# Altium project Relay Controller REV2.PrjPcb
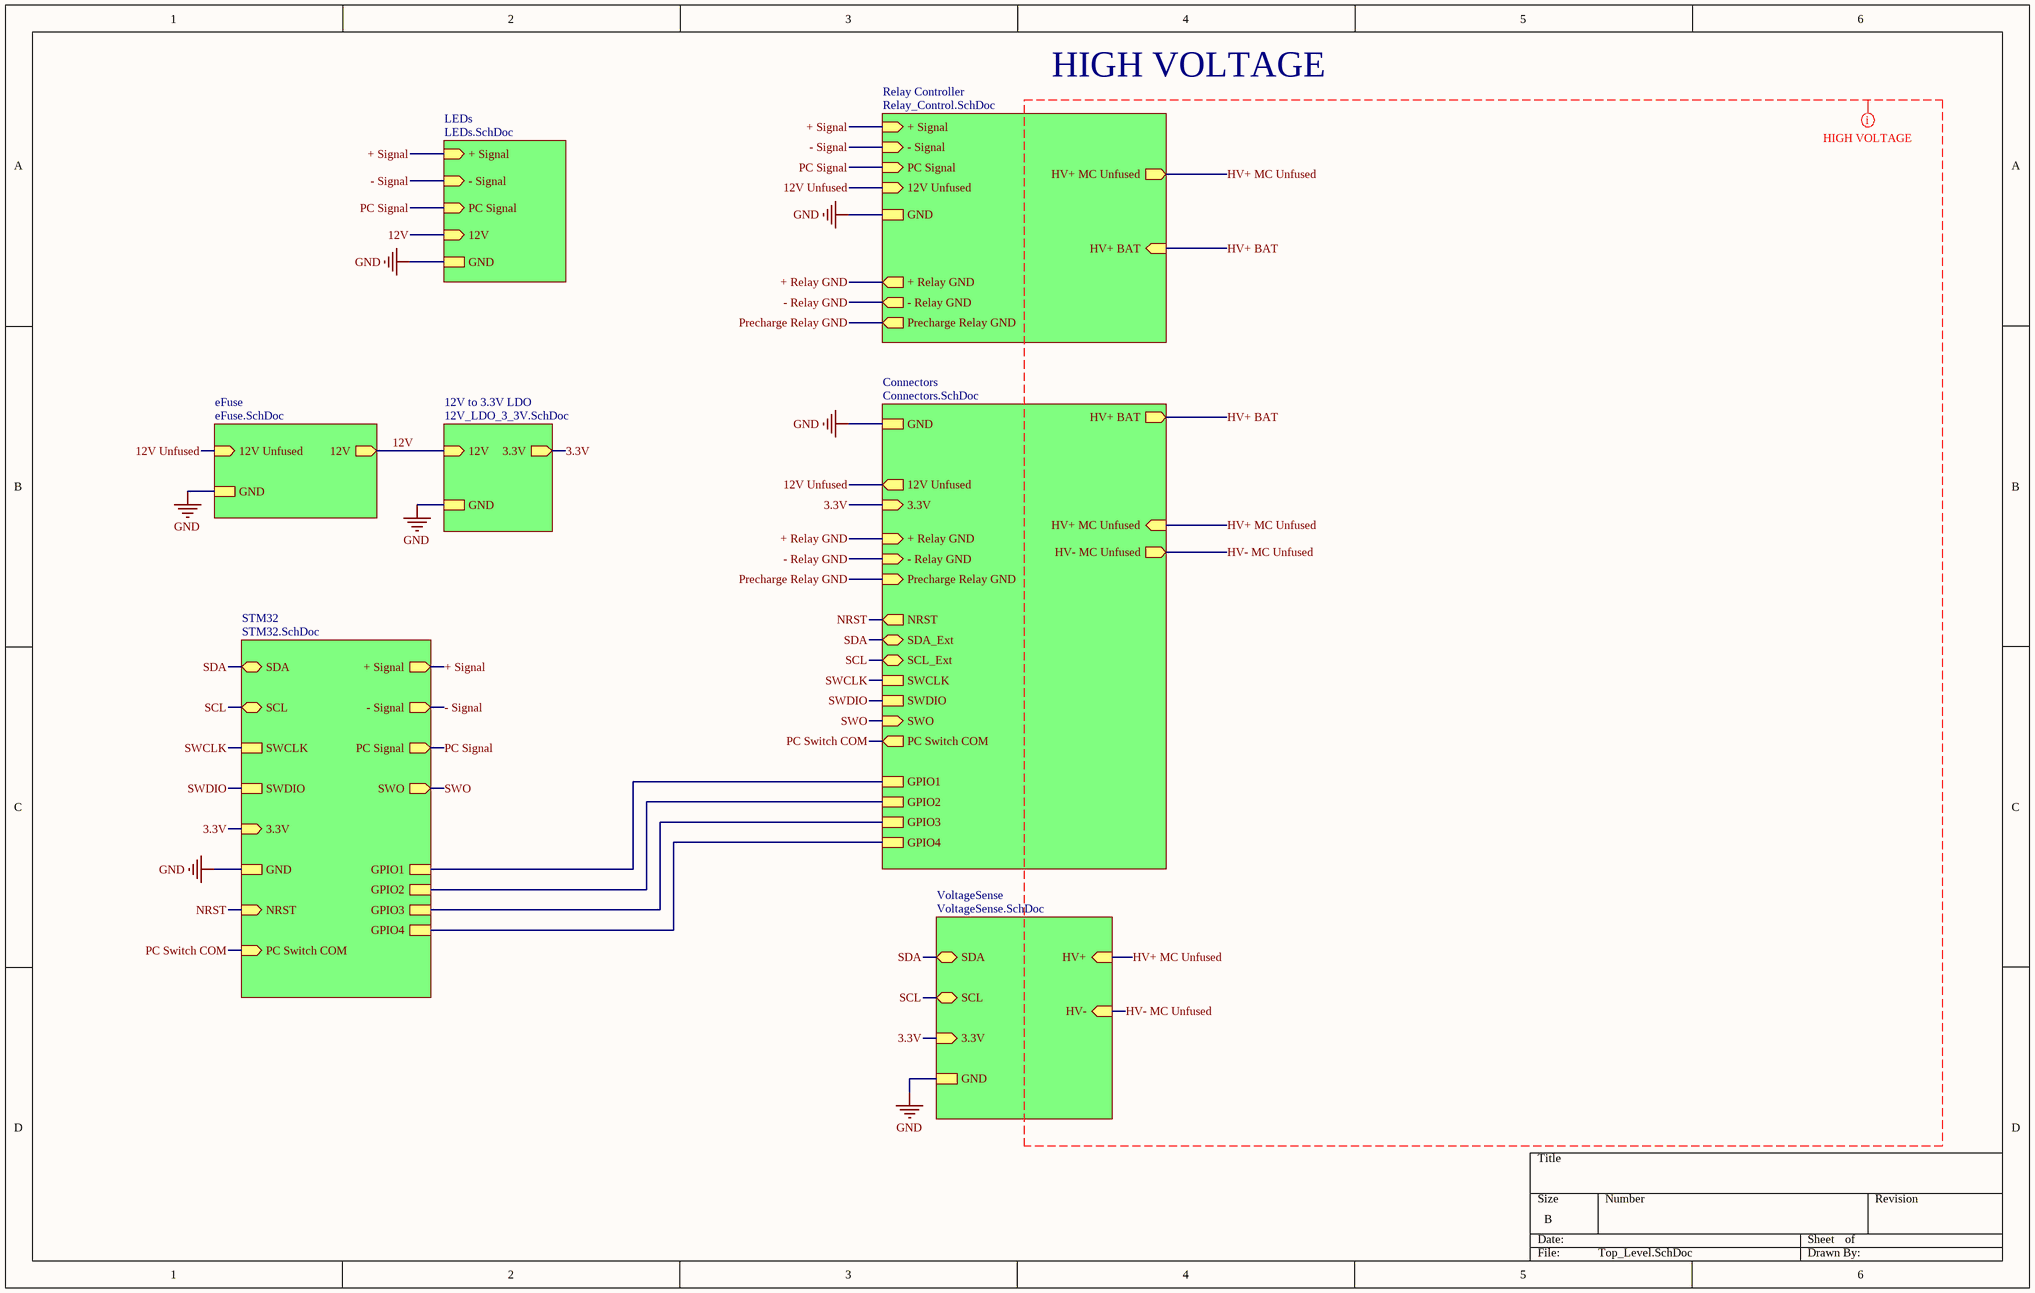
[diagram p0: Top_Level.SchDoc]
9 sheets, 78 parts. Net scope: hierarchical (ports join the sheet entries above them; power ports are global).
Board file: Relay_Controller_REV2.PcbDoc
Sheets:
  Top_Level.SchDoc
    Relay Controller = Relay_Control.SchDoc
    Connectors = Connectors.SchDoc
    LEDs = LEDs.SchDoc
      U_LED = LED_Driver.SchDoc
      U_LED = LED_Driver.SchDoc
      U_LED = LED_Driver.SchDoc
    STM32 = STM32.SchDoc
    VoltageSense = VoltageSense.SchDoc
    eFuse = eFuse.SchDoc
    12V to 3.3V LDO = 12V_LDO_3_3V.SchDoc

## Sheet Top_Level.SchDoc
size B; SheetNumber: 5; SheetTotal: 5

### Sub-sheets
12V to 3.3V LDO = 12V_LDO_3_3V.SchDoc: 12V (in), GND, 3.3V (out)
Connectors = Connectors.SchDoc: GND, + Relay GND (in), - Relay GND (in), Precharge Relay GND (in), HV+ BAT (out), 12V Unfused (out), HV+ MC Unfused (in), HV- MC Unfused (out), 3.3V (in), SDA_Ext (bidir), SCL_Ext (bidir), SWCLK, SWDIO, SWO (in), NRST (out), GPIO1, GPIO2, GPIO3, GPIO4, PC Switch COM (out)
eFuse = eFuse.SchDoc: 12V Unfused (in), GND, 12V (out)
LEDs = LEDs.SchDoc: + Signal (in), - Signal (in), PC Signal (in), 12V (in), GND
Relay Controller = Relay_Control.SchDoc: + Signal (in), - Signal (in), PC Signal (in), 12V Unfused (in), GND, + Relay GND (out), - Relay GND (out), Precharge Relay GND (out), HV+ MC Unfused (out), HV+ BAT (in)
STM32 = STM32.SchDoc: SDA (bidir), SCL (bidir), 3.3V (in), + Signal (out), - Signal (out), PC Signal (out), GND, SWCLK, SWDIO, SWO (out), NRST (in), GPIO1, GPIO2, GPIO3, GPIO4, PC Switch COM (in)
VoltageSense = VoltageSense.SchDoc: HV+ (in), HV- (in), 3.3V (in), SDA (bidir), SCL (bidir), GND

### Nets
GND: sheet Relay Controller/GND, sheet Connectors/GND, sheet LEDs/GND, sheet STM32/GND, sheet VoltageSense/GND, sheet eFuse/GND, sheet 12V to 3.3V LDO/GND
3.3V: sheet Connectors/3.3V, sheet STM32/3.3V, sheet VoltageSense/3.3V, sheet 12V to 3.3V LDO/3.3V
12V: sheet LEDs/12V, sheet eFuse/12V, sheet 12V to 3.3V LDO/12V
12V Unfused: sheet Relay Controller/12V Unfused, sheet Connectors/12V Unfused, sheet eFuse/12V Unfused
+ Relay GND: sheet Relay Controller/+ Relay GND, sheet Connectors/+ Relay GND
+ Signal: sheet Relay Controller/+ Signal, sheet LEDs/+ Signal, sheet STM32/+ Signal
- Relay GND: sheet Relay Controller/- Relay GND, sheet Connectors/- Relay GND
- Signal: sheet Relay Controller/- Signal, sheet LEDs/- Signal, sheet STM32/- Signal
HV+ BAT: sheet Relay Controller/HV+ BAT, sheet Connectors/HV+ BAT
HV+ MC Unfused: sheet Relay Controller/HV+ MC Unfused, sheet Connectors/HV+ MC Unfused, sheet VoltageSense/HV+
HV- MC Unfused: sheet Connectors/HV- MC Unfused, sheet VoltageSense/HV-
NRST: sheet Connectors/NRST, sheet STM32/NRST
PC Signal: sheet Relay Controller/PC Signal, sheet LEDs/PC Signal, sheet STM32/PC Signal
PC Switch COM: sheet Connectors/PC Switch COM, sheet STM32/PC Switch COM
Precharge Relay GND: sheet Relay Controller/Precharge Relay GND, sheet Connectors/Precharge Relay GND
SCL: sheet Connectors/SCL_Ext, sheet STM32/SCL, sheet VoltageSense/SCL
SDA: sheet Connectors/SDA_Ext, sheet STM32/SDA, sheet VoltageSense/SDA
SWCLK: sheet Connectors/SWCLK, sheet STM32/SWCLK
SWDIO: sheet Connectors/SWDIO, sheet STM32/SWDIO
SWO: sheet Connectors/SWO, sheet STM32/SWO
NetIC3_21: sheet Connectors/GPIO1, sheet STM32/GPIO1
NetIC3_23: sheet Connectors/GPIO2, sheet STM32/GPIO2
NetIC3_25: sheet Connectors/GPIO3, sheet STM32/GPIO3
NetIC3_27: sheet Connectors/GPIO4, sheet STM32/GPIO4

### Layout directives
mark named HIGH VOLTAGE: HV+ BAT, HV+ MC Unfused, HV- MC Unfused

### Notes on the sheet
- HIGH VOLTAGE

## Sheet Relay_Control.SchDoc
size A; SheetNumber: 2; SheetTotal: 5
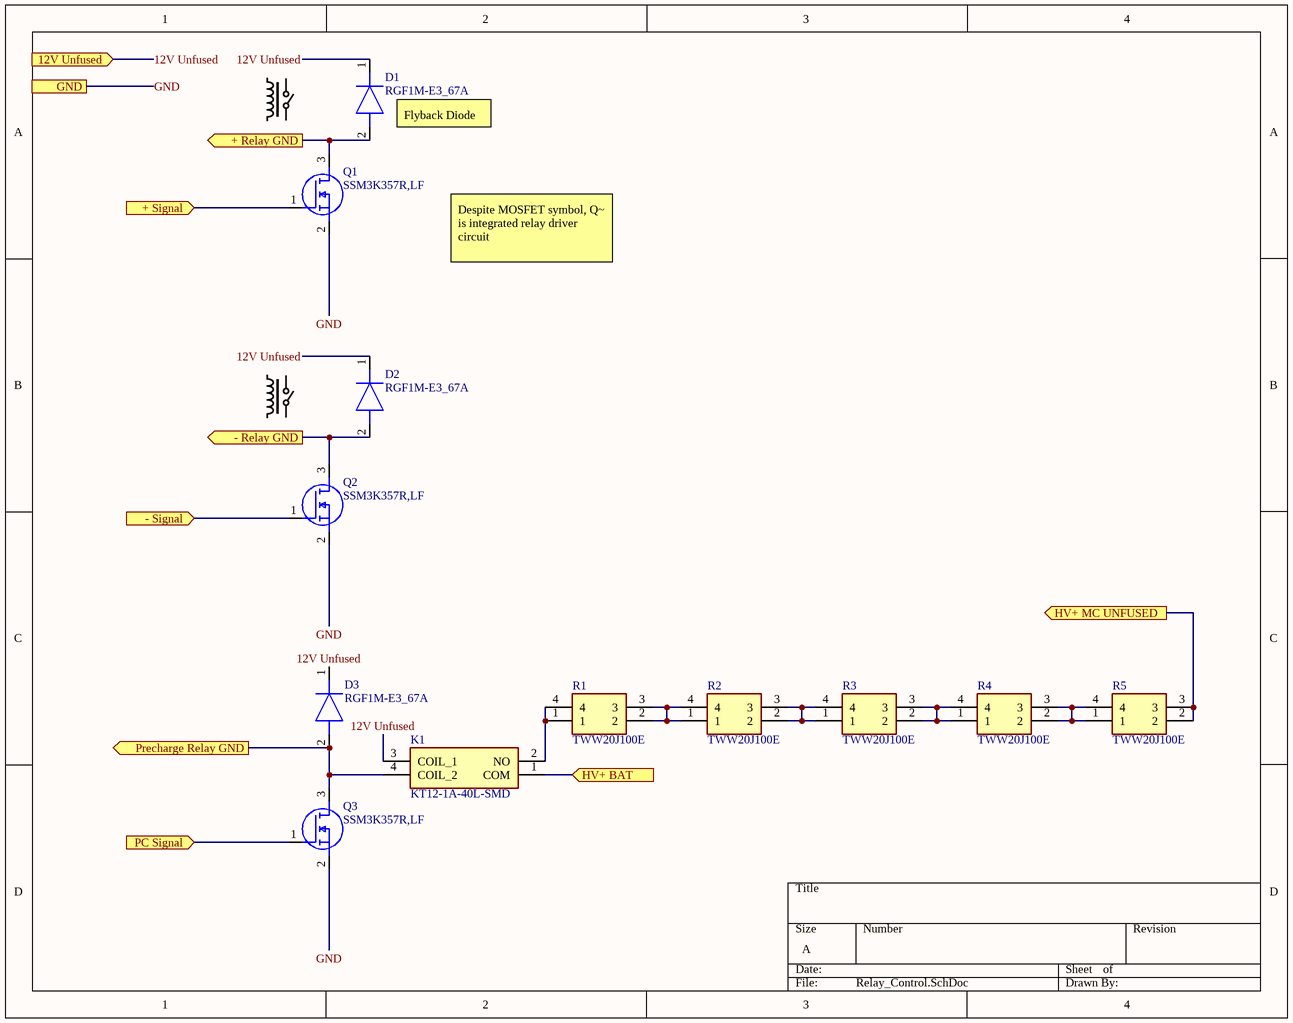
[diagram p1: Relay_Control.SchDoc]

### Parts
D1  RGF1M-E3_67A  [DIOM5426X300N]
D2  RGF1M-E3_67A  [DIOM5426X300N]
D3  RGF1M-E3_67A  [DIOM5426X300N]
K1  KT12-1A-40L-SMD  [KT121A40LSMD]
Q1  SSM3K357R,LF  [SOTFL95P240X88-3N]
Q2  SSM3K357R,LF  [SOTFL95P240X88-3N]
Q3  SSM3K357R,LF  [SOTFL95P240X88-3N]
R1  TWW20J100E  [TWW20J100E]
R2  TWW20J100E  [TWW20J100E]
R3  TWW20J100E  [TWW20J100E]
R4  TWW20J100E  [TWW20J100E]
R5  TWW20J100E  [TWW20J100E]

### Ports
12V Unfused (in), + Relay GND (out), + Signal (in), - Relay GND (out), - Signal (in), GND, HV+ BAT (in), HV+ MC UNFUSED (out), PC Signal (in), Precharge Relay GND (out)

### Nets
GND: Q1.2(S) Q2.2(S) Q3.2(S) ; port GND
12V Unfused: D1.1(K) D2.1(K) D3.1(K) K1.3(COIL_1) ; port 12V Unfused
+ Relay GND: D1.2(A) Q1.3(D) ; port + Relay GND
+ Signal: Q1.1(G) ; port + Signal
- Relay GND: D2.2(A) Q2.3(D) ; port - Relay GND
- Signal: Q2.1(G) ; port - Signal
HV+ BAT: K1.1(COM) ; port HV+ BAT
HV+ MC Unfused: R5.2 R5.3 ; port HV+ MC UNFUSED
PC Signal: Q3.1(G) ; port PC Signal
Precharge Relay GND: D3.2(A) K1.4(COIL_2) Q3.3(D) ; port Precharge Relay GND
NetK1_2: K1.2(NO) R1.1 R1.4
NetR1_2: R1.2 R1.3 R2.1 R2.4
NetR2_2: R2.2 R2.3 R3.1 R3.4
NetR3_2: R3.2 R3.3 R4.1 R4.4
NetR4_2: R4.2 R4.3 R5.1 R5.4

### Notes on the sheet
- (near D1) Flyback Diode
- Despite MOSFET symbol, Q~ is integrated relay driver circuit

### Library data of the parts
D1-D3 = RGF1M-E3_67A: Diode; Manufacturer_Name: Vishay; Manufacturer_Part_Number: RGF1M-E3/67A; Datasheet Link: https://www.vishay.com/docs/88697/rgf1.pdf; Height: 3mm; Mouser Part Number: 625-RGF1M-E3; Mouser Price/Stock: https://www.mouser.co.uk/ProductDetail/Vishay-General-Semiconductor/RGF1M-E3-67A?qs=4xyK702%2F%252BQ1dl%252BTCdyIThg%3D%3D; Arrow Part Number: RGF1M-E3/67A; Arrow Price/Stock: https://www.arrow.com/en/products/rgf1m-e367a/vishay?region=nac
K1 = KT12-1A-40L-SMD: Relay or Contactor; Manufacturer_Name: STANDEXMEDER; Datasheet Link: https://standexelectronics.com/resources/technical-library/technical-papers/datasheet-kt-series-reed-relay/; Height: 8.7mm; Manufacturer_Part_Number: KT12-1A-40L-SMD; Mouser Part Number: 876-KT12-1A-40L-SMD; Arrow Part Number: KT12-1A-40L-SMD; Arrow Price/Stock: https://www.arrow.com/en/products/kt12-1a-40l-smd/standex-meder-electronics
Q1-Q3 = SSM3K357R,LF: MOSFET (N-Channel); Manufacturer_Name: Toshiba; Datasheet Link: https://toshiba.semicon-storage.com/info/docget.jsp?did=59207&prodName=SSM3K357R; Height: 0.88mm; Manufacturer_Part_Number: SSM3K357R,LF; Mouser Part Number: 757-SSM3K357RLF; Mouser Price/Stock: https://www.mouser.co.uk/ProductDetail/Toshiba/SSM3K357RLF?qs=F5EMLAvA7ICLn4Y138U4bA%3D%3D; Arrow Part Number: SSM3K357R,LF; Arrow Price/Stock: https://www.arrow.com/en/products/ssm3k357rlf/toshiba?utm_currency=USD&region=nac
R1-R5 = TWW20J100E: Resistor; Manufacturer_Name: Ohmite; Datasheet Link: https://www.mouser.in/datasheet/2/303/res_tww_twm-1228653.pdf; Height: 46mm; Manufacturer_Part_Number: TWW20J100E; Mouser Part Number: 588-TWW20J100E; Mouser Price/Stock: https://www.mouser.co.uk/ProductDetail/Ohmite/TWW20J100E?qs=PzGy0jfpSMsE3rbWfgqD2A%3D%3D

## Sheet Connectors.SchDoc
size A; SheetNumber: 3; SheetTotal: 5
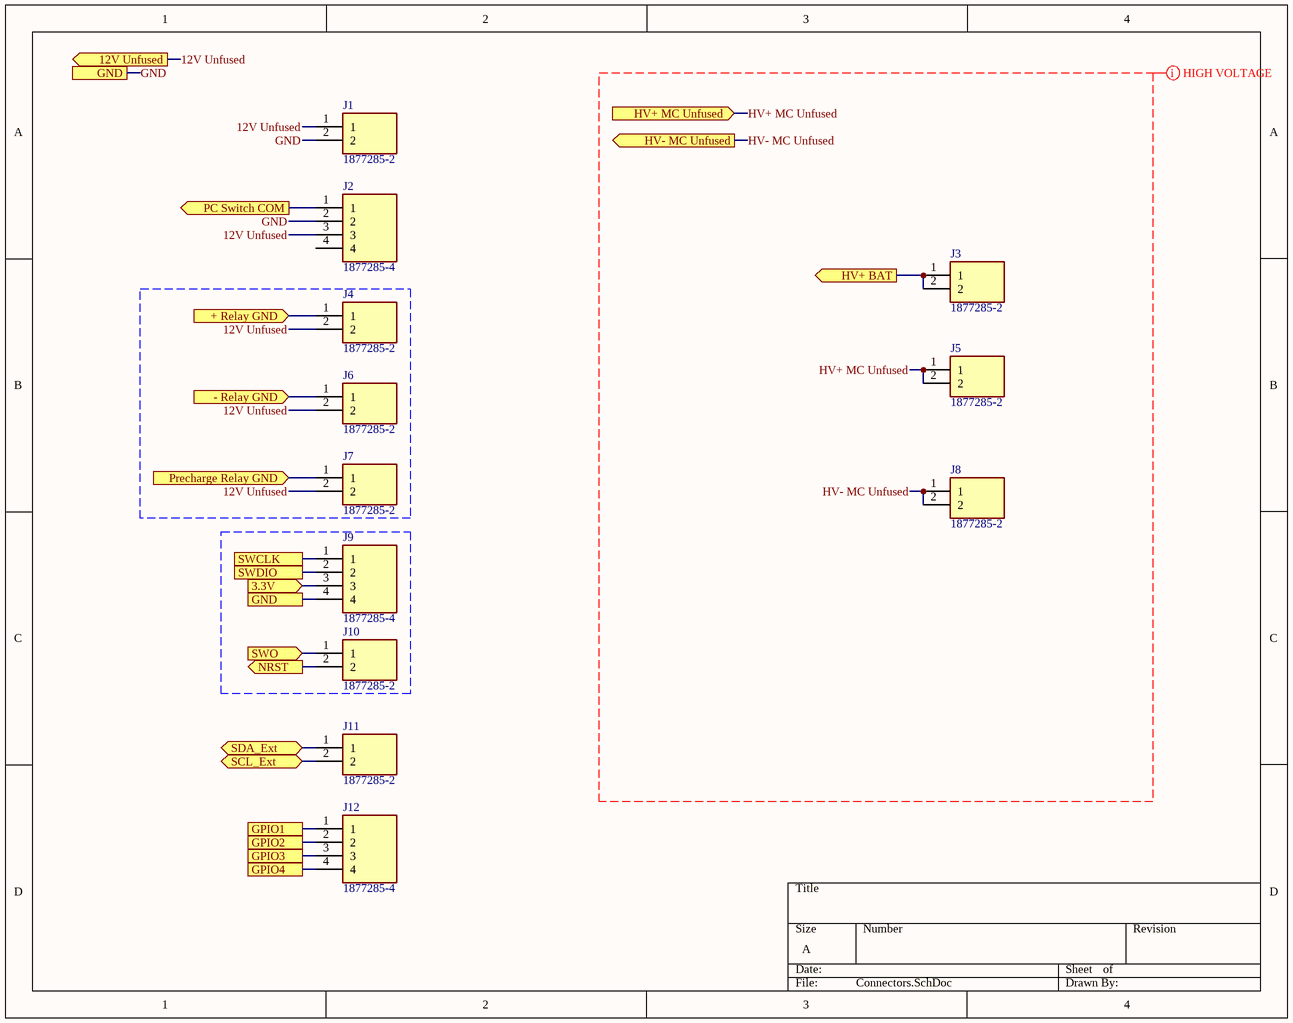
[diagram p2: Connectors.SchDoc]

### Parts
J1  1877285-2  [18772852]
J2  1877285-4  [18772854]
J3  1877285-2  [18772852]
J4  1877285-2  [18772852]
J5  1877285-2  [18772852]
J6  1877285-2  [18772852]
J7  1877285-2  [18772852]
J8  1877285-2  [18772852]
J9  1877285-4  [18772854]
J10  1877285-2  [18772852]
J11  1877285-2  [18772852]
J12  1877285-4  [18772854]

### Ports
3.3V (in), 12V Unfused (out), + Relay GND (in), - Relay GND (in), GND, GPIO1, GPIO2, GPIO3, GPIO4, HV+ BAT (out), HV+ MC Unfused (in), HV- MC Unfused (out), NRST (out), PC Switch COM (out), Precharge Relay GND (in), SCL_Ext (bidir), SDA_Ext (bidir), SWCLK, SWDIO, SWO (in)

### Nets
GND: J1.2 J2.2 J9.4 ; port GND
3.3V: J9.3 ; port 3.3V
12V Unfused: J1.1 J2.3 J4.2 J6.2 J7.2 ; port 12V Unfused
+ Relay GND: J4.1 ; port + Relay GND
- Relay GND: J6.1 ; port - Relay GND
HV+ BAT: J3.1 J3.2 ; port HV+ BAT
HV+ MC Unfused: J5.1 J5.2 ; port HV+ MC Unfused
HV- MC Unfused: J8.1 J8.2 ; port HV- MC Unfused
NRST: J10.2 ; port NRST
PC Switch COM: J2.1 ; port PC Switch COM
Precharge Relay GND: J7.1 ; port Precharge Relay GND
SCL: J11.2 ; port SCL_Ext
SDA: J11.1 ; port SDA_Ext
SWCLK: J9.1 ; port SWCLK
SWDIO: J9.2 ; port SWDIO
SWO: J10.1 ; port SWO
NetIC3_21: J12.1 ; port GPIO1
NetIC3_23: J12.2 ; port GPIO2
NetIC3_25: J12.3 ; port GPIO3
NetIC3_27: J12.4 ; port GPIO4

Not connected (* = marked no-connect by the designer): J2 4

### Layout directives
mark named HIGH VOLTAGE: HV+ MC Unfused, HV- MC Unfused

### Library data of the parts
J1 J3-J8 J10 J11 = 1877285-2: Connector; Manufacturer_Name: TE Connectivity; Datasheet Link: https://www.te.com/commerce/DocumentDelivery/DDEController?Action=srchrtrv&DocNm=7-1773458-5_ECONOMY_POWER_QRG&DocType=Data%20Sheet&DocLang=English&PartCntxt=1877285-2&DocFormat=pdf; Height: 12mm; Manufacturer_Part_Number: 1877285-2; Mouser Part Number: 571-1877285-2; Mouser Price/Stock: https://www.mouser.co.uk/ProductDetail/TE-Connectivity/1877285-2?qs=ka3zfMQDmFlAIZq5pDt5JA%3D%3D; Arrow Part Number: 1877285-2; Arrow Price/Stock: https://www.arrow.com/en/products/1877285-2/te-connectivity?region=europe
J2 J9 J12 = 1877285-4: Connector; Manufacturer_Name: TE Connectivity; Datasheet Link: https://www.te.com/commerce/DocumentDelivery/DDEController?Action=srchrtrv&DocNm=1877285&DocType=Customer%20Drawing&DocLang=English&PartCntxt=1877285-4&DocFormat=pdf; Height: 12.5mm; Manufacturer_Part_Number: 1877285-4; Mouser Part Number: 571-1877285-4; Mouser Price/Stock: https://www.mouser.co.uk/ProductDetail/TE-Connectivity/1877285-4?qs=ka3zfMQDmFkZPBtotDIXvQ%3D%3D; Arrow Part Number: 1877285-4; Arrow Price/Stock: https://www.arrow.com/en/products/1877285-4/te-connectivity?region=nac

## Sheet LEDs.SchDoc
size A; SheetNumber: 4; SheetTotal: 5
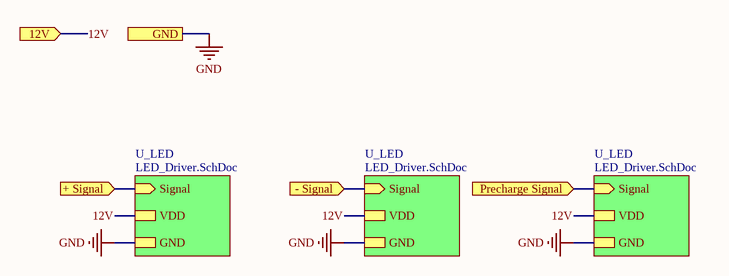
[diagram p3: LEDs.SchDoc]

### Sub-sheets
U_LED = LED_Driver.SchDoc: Signal (in), VDD, GND
U_LED = LED_Driver.SchDoc: Signal (in), VDD, GND
U_LED = LED_Driver.SchDoc: Signal (in), VDD, GND

### Ports
12V (in), + Signal (in), - Signal (in), GND, Precharge Signal (in)

### Nets
GND: port GND, sheet U_LED/GND, sheet U_LED/GND, sheet U_LED/GND
12V: port 12V, sheet U_LED/VDD, sheet U_LED/VDD, sheet U_LED/VDD
+ Signal: port + Signal, sheet U_LED/Signal
- Signal: port - Signal, sheet U_LED/Signal
NetICLED1_1: port Precharge Signal, sheet U_LED/Signal

## Sheet LED_Driver.SchDoc
size A; SheetNumber: 5; SheetTotal: 5
Used 3 times, as channels LEDs/U_LED, LEDs/U_LED, LEDs/U_LED. Parts and nets are listed once, with the designators drawn on the sheet.
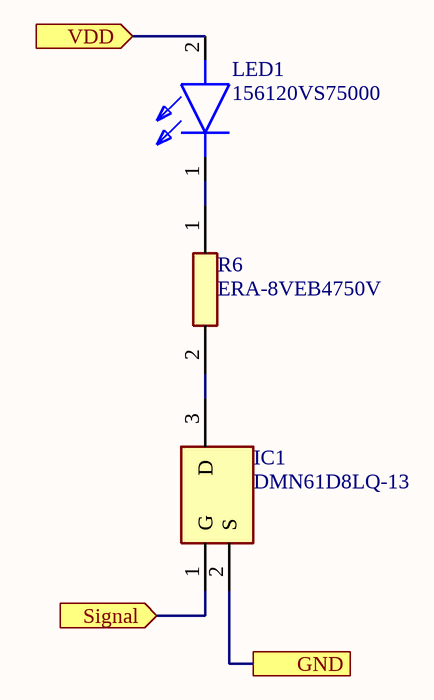
[diagram p4: LED_Driver.SchDoc]

### Parts
IC1  DMN61D8LQ-13  [SOT96P240X110-3N]
LED1  156120VS75000  [156120VS75000]
R6  ERA-8VEB4750V  [ERA8KEB1004V]

### Ports
GND, Signal (in), VDD (in)

### Nets
GND: IC1.2(S) ; port GND
Signal: IC1.1(G) ; port Signal
VDD: LED1.2(A) ; port VDD
NetIC1_3: IC1.3(D) R6.2
NetLED1_1: LED1.1(K) R6.1

### Channels
LEDs/U_LED: designators IC1=ICLED3 LED1=+_Sig R6=R6LED3; ports GND=GND Signal=+ Signal VDD=12V
LEDs/U_LED: designators IC1=ICLED2 LED1=-_Sig R6=R6LED2; ports GND=GND Signal=- Signal VDD=12V
LEDs/U_LED: designators IC1=ICLED1 LED1=PC_Sig R6=R6LED1; ports GND=GND Signal=NetICLED1_1 VDD=12V

### Library data of the parts
IC1 = DMN61D8LQ-13: Integrated Circuit; Manufacturer_Name: Diodes Incorporated; Datasheet Link: https://www.diodes.com//assets/Datasheets/DMN61D8LQ.pdf; Height: 1.1mm; Manufacturer_Part_Number: DMN61D8LQ-13; Mouser Part Number: 621-DMN61D8LQ-13; Mouser Price/Stock: https://www.mouser.co.uk/ProductDetail/Diodes-Incorporated/DMN61D8LQ-13?qs=DBvH5xl4UymJgoulTjiNCg%3D%3D; Arrow Part Number: DMN61D8LQ-13; Arrow Price/Stock: https://www.arrow.com/en/products/dmn61d8lq-13/diodes-incorporated?utm_currency=USD&region=nac
LED1 = 156120VS75000: LED; Manufacturer_Name: Wurth Elektronik; Datasheet Link: https://www.we-online.com/components/products/datasheet/156120VS75000.pdf; Height: 1.3mm; Manufacturer_Part_Number: 156120VS75000; Mouser Part Number: 710-156120VS75000; Mouser Price/Stock: https://www.mouser.co.uk/ProductDetail/Wurth-Elektronik/156120VS75000?qs=2kOmHSv6VfQAUFg5BeuEfQ%3D%3D
R6 = ERA-8VEB4750V: Resistor; Manufacturer_Name: Panasonic; Datasheet Link: https://industrial.panasonic.com/cdbs/www-data/pdf/RDM0000/RDM0000C331.pdf; Height: 0.65mm; Manufacturer_Part_Number: ERA-8VEB4750V; Mouser Part Number: 667-ERA-8VEB4750V; Mouser Price/Stock: https://www.mouser.co.uk/ProductDetail/Panasonic/ERA-8VEB4750V?qs=By6Nw2ByBD36LBLC0KPpEw%3D%3D

## Sheet STM32.SchDoc
size A; SheetNumber: 3; SheetTotal: 5
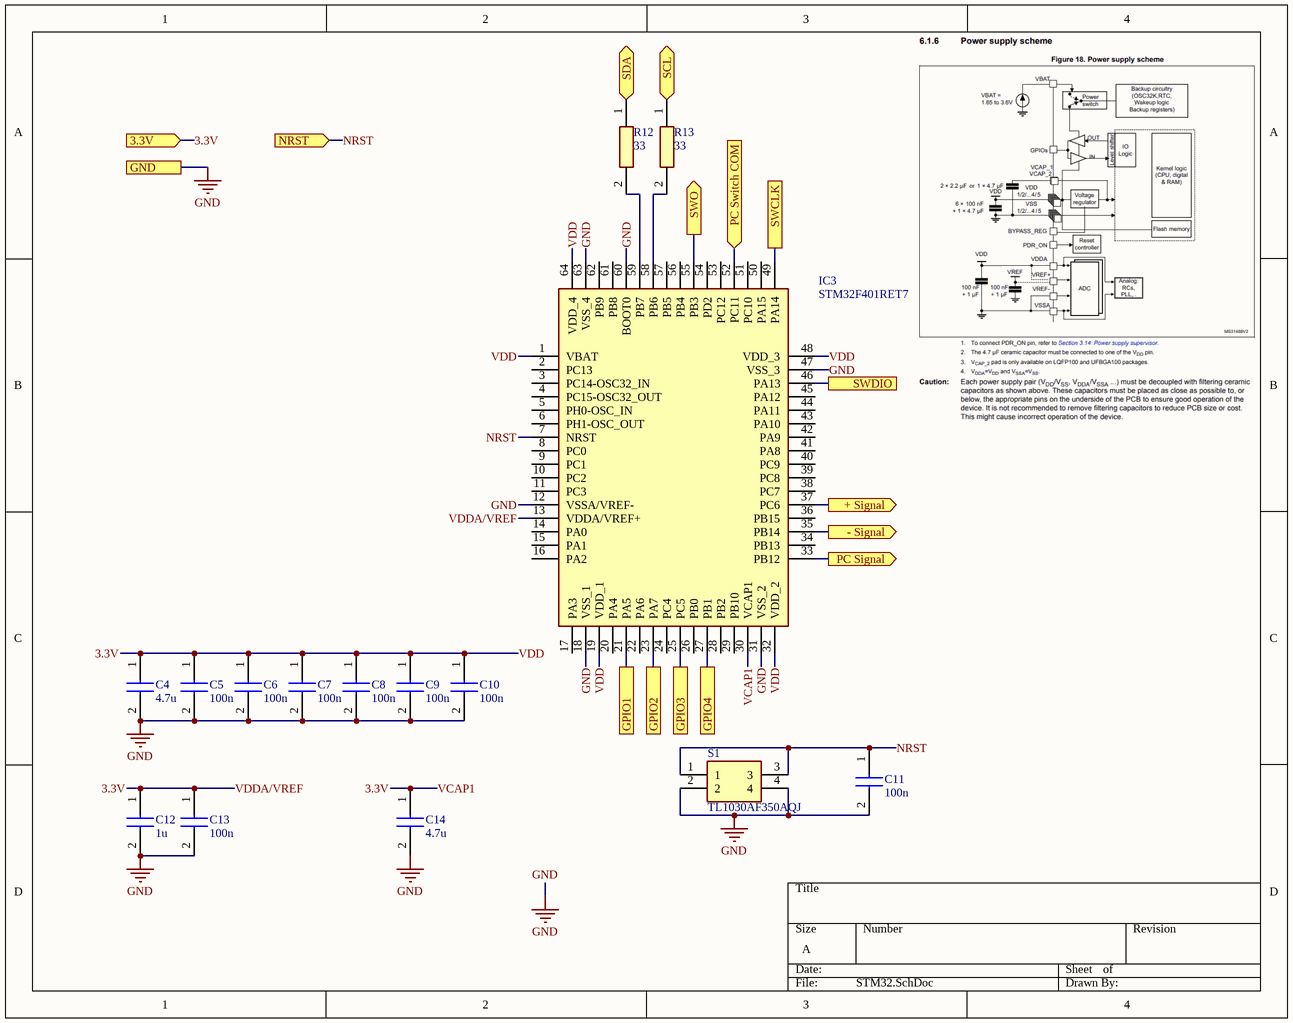
[diagram p5: STM32.SchDoc]

### Parts
C4  4.7u  [CAPC3216X180N]
C5  100n  [CAPC3216X94N]
C6  100n  [CAPC3216X94N]
C7  100n  [CAPC3216X94N]
C8  100n  [CAPC3216X94N]
C9  100n  [CAPC3216X94N]
C10  100n  [CAPC3216X94N]
C11  100n  [CAPC3216X94N]
C12  1u  [CAPC3216X180N]
C13  100n  [CAPC3216X94N]
C14  4.7u  [CAPC3216X180N]
IC3  STM32F401RET7  [QFP50P1200X1200X160-64N]
R12  33  [ERJ8ENF1000V]
R13  33  [ERJ8ENF1000V]
S1  TL1030AF350AQJ  [TL1030AF350AQJ]

### Ports
3.3V (in), + Signal (out), - Signal (out), GND, GPIO1, GPIO2, GPIO3, GPIO4, NRST (in), PC Signal (out), PC Switch COM (in), SCL (bidir), SDA (bidir), SWCLK, SWDIO, SWO (out)

### Nets
GND: C4.2 C5.2 C6.2 C7.2 C8.2 C9.2 C10.2 C11.2 C12.2 C13.2 C14.2 IC3.12(VSSA/VREF-) IC3.18(VSS_1) IC3.31(VSS_2) IC3.47(VSS_3) IC3.60(BOOT0) IC3.63(VSS_4) S1.2 S1.4 ; port GND
3.3V: C4.1 C5.1 C6.1 C7.1 C8.1 C9.1 C10.1 C12.1 C13.1 C14.1 IC3.1(VBAT) IC3.13(VDDA/VREF+) IC3.19(VDD_1) IC3.30(VCAP1) IC3.32(VDD_2) IC3.48(VDD_3) IC3.64(VDD_4) ; port 3.3V  [also labelled VCAP1, VDD, VDDA/VREF]
+ Signal: IC3.37(PC6) ; port + Signal
- Signal: IC3.35(PB14) ; port - Signal
NRST: C11.1 IC3.7(NRST) S1.1 S1.3 ; port NRST
PC Signal: IC3.33(PB12) ; port PC Signal
PC Switch COM: IC3.52(PC11) ; port PC Switch COM
SCL: R13.1 ; port SCL
SDA: R12.1 ; port SDA
SWCLK: IC3.49(PA14) ; port SWCLK
SWDIO: IC3.46(PA13) ; port SWDIO
SWO: IC3.55(PB3) ; port SWO
NetIC3_21: IC3.21(PA5) ; port GPIO1
NetIC3_23: IC3.23(PA7) ; port GPIO2
NetIC3_25: IC3.25(PC5) ; port GPIO3
NetIC3_27: IC3.27(PB1) ; port GPIO4
NetIC3_58: IC3.58(PB6) R13.2
NetIC3_59: IC3.59(PB7) R12.2

Not connected (* = marked no-connect by the designer): IC3 2(PC13) 3(PC14-OSC32_IN) 4(PC15-OSC32_OUT) 5(PH0-OSC_IN) 6(PH1-OSC_OUT) 8(PC0) 9(PC1) 10(PC2) 11(PC3) 14(PA0) 15(PA1) 16(PA2) 17(PA3) 20(PA4) 22(PA6) 24(PC4) 26(PB0) 28(PB2) 29(PB10) 34(PB13) 36(PB15) 38(PC7) 39(PC8) 40(PC9) 41(PA8) 42(PA9) 43(PA10) 44(PA11) 45(PA12) 50(PA15) 51(PC10) 53(PC12) 54(PD2) 56(PB4) 57(PB5) 61(PB8) 62(PB9)

### Library data of the parts
C4 C14 = GMK316AB7475KLHT: Capacitor; Manufacturer_Name: TAIYO YUDEN; Datasheet Link: https://ds.yuden.co.jp/TYCOMPAS/ap/specSheet?pn=MMASG31LAB7475KTNA01; Height: 1.8mm; Manufacturer_Part_Number: GMK316AB7475KLHT; Mouser Part Number: 963-GMK316AB7475KLHT; Mouser Price/Stock: https://www.mouser.co.uk/ProductDetail/TAIYO-YUDEN/GMK316AB7475KLHT?qs=CNQs48zzdnoeKLJ9%2F6WNWQ%3D%3D; Arrow Part Number: GMK316AB7475KLHT; Arrow Price/Stock: https://www.arrow.com/en/products/gmk316ab7475klht/taiyo-yuden?utm_currency=USD&region=nac
C5-C11 C13 = 12065C104J4Z2A: Capacitor; Manufacturer_Name: Kyocera AVX; Datasheet Link: https://spicat.kyocera-avx.com/product/mlcc/chartview/12065C104J4Z2A/DataSheet/X7R; Height: 0.94mm; Manufacturer_Part_Number: 12065C104J4Z2A; Mouser Part Number: 581-12065C104J4Z2A; Mouser Price/Stock: https://www.mouser.com/Search/Refine.aspx?Keyword=581-12065C104J4Z2A
C12 = HMK316B7105KLHT: Capacitor; Manufacturer_Name: TAIYO YUDEN; Datasheet Link: https://mouser.componentsearchengine.com/Datasheets/1/HMK316B7105KLHT.pdf; Height: 1.8mm; Manufacturer_Part_Number: HMK316B7105KLHT; Mouser Part Number: 963-HMK316B7105KLHT; Mouser Price/Stock: https://www.mouser.co.uk/ProductDetail/TAIYO-YUDEN/HMK316B7105KLHT?qs=sz8xDBnIhcFmvpGfTAF0nQ%3D%3D; Arrow Part Number: HMK316B7105KLHT; Arrow Price/Stock: null?utm_currency=USD&region=nac
IC3 = STM32F401RET7: Integrated Circuit; Manufacturer_Name: STMicroelectronics; Datasheet Link: https://www.arrow.com/en/products/stm32f401ret7/stmicroelectronics; Height: 1.6mm; Manufacturer_Part_Number: STM32F401RET7; Mouser Part Number: 511-STM32F401RET7; Mouser Price/Stock: https://www.mouser.co.uk/ProductDetail/STMicroelectronics/STM32F401RET7?qs=aVyJF2WnouSdX21y3k%2FIAA%3D%3D; Arrow Part Number: STM32F401RET7; Arrow Price/Stock: https://www.arrow.com/en/products/stm32f401ret7/stmicroelectronics?utm_currency=USD&region=nac
R12 R13 = ERJ-8ENF33R0V: Resistor; Manufacturer_Name: Panasonic; Datasheet Link: https://industrial.panasonic.com/cdbs/www-data/pdf/RDA0000/AOA0000C86.pdf; Height: 0.7mm; Manufacturer_Part_Number: ERJ-8ENF33R0V; Mouser Part Number: 667-ERJ-8ENF33R0V; Mouser Price/Stock: https://www.mouser.co.uk/ProductDetail/Panasonic/ERJ-8ENF33R0V?qs=8%252BG0TiN%2FgVpb1yH%2F8k6uQg%3D%3D
S1 = TL1030AF350AQJ: Switch; Manufacturer_Name: E-Switch; Datasheet Link: https://configured-product-images.s3.amazonaws.com/2D/specs/TL1030AF350AQJ.pdf; Height: 1.95mm; Manufacturer_Part_Number: TL1030AF350AQJ; Mouser Part Number: 612-TL1030AF350AQJ; Mouser Price/Stock: https://www.mouser.co.uk/ProductDetail/E-Switch/TL1030AF350AQJ?qs=VVKQmw408U%2FgalG8VZqjEg%3D%3D

## Sheet VoltageSense.SchDoc
size A; SheetNumber: 5; SheetTotal: 5
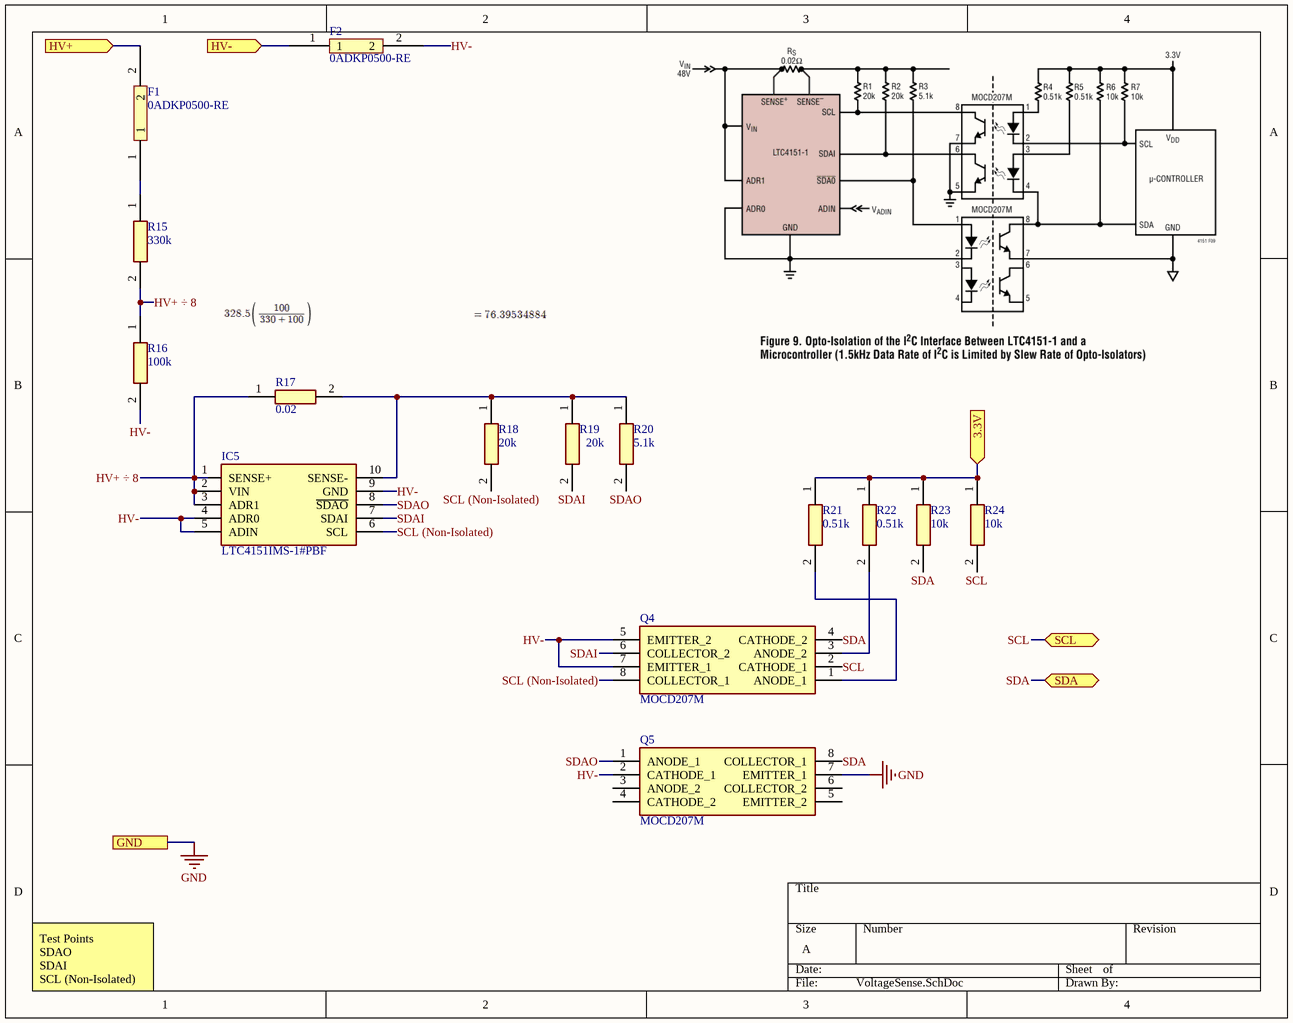
[diagram p6: VoltageSense.SchDoc]

### Parts
F1  0ADKP0500-RE  [0ADKP0500-RE]
F2  0ADKP0500-RE  [0ADKP0500-RE]
IC5  LTC4151IMS-1#PBF  [SOP50P490X110-10N]
Q4  MOCD207M  [SOIC127P594X363-8N]
Q5  MOCD207M  [SOIC127P594X363-8N]
R15  330k  [ERJP08_(1206)]
R16  100k  [RESC3216X65N]
R17  0.02  [RESC3216X68N]
R18  20k  [RESC3216X70N]
R19  20k  [RESC3216X70N]
R20  5.1k  [RESC3116X65N]
R21  0.51k  [RESC3216X65N]
R22  0.51k  [RESC3216X65N]
R23  10k  [ERJP08_(1206)]
R24  10k  [ERJP08_(1206)]

### Ports
3.3V (in), GND, HV+ (in), HV- (in), SCL (bidir), SDA (bidir)

### Nets
GND: Q5.7(EMITTER_1) ; port GND
3.3V: R21.1 R22.1 R23.1 R24.1 ; port 3.3V
HV+ MC Unfused: F1.2 ; port HV+
HV+ ÷ 8: IC5.1(SENSE+) IC5.2(VIN) IC5.3(ADR1) R15.2 R16.1 R17.1
HV-: F2.2 IC5.4(ADR0) IC5.5(ADIN) IC5.9(GND) Q4.5(EMITTER_2) Q4.7(EMITTER_1) Q5.2(CATHODE_1) R16.2
HV- MC Unfused: F2.1 ; port HV-
SCL: Q4.2(CATHODE_1) R24.2 ; port SCL
SCL (Non-Isolated): IC5.6(SCL) Q4.8(COLLECTOR_1) R18.2
SDA: Q4.4(CATHODE_2) Q5.8(COLLECTOR_1) R23.2 ; port SDA
SDAI: IC5.7(SDAI) Q4.6(COLLECTOR_2) R19.2
SDAO: IC5.8(~{SDAO}) Q5.1(ANODE_1) R20.2
NetF1_1: F1.1 R15.1
NetIC5_10: IC5.10(SENSE-) R17.2 R18.1 R19.1 R20.1
NetQ4_1: Q4.1(ANODE_1) R21.2
NetQ4_3: Q4.3(ANODE_2) R22.2

Not connected (* = marked no-connect by the designer): Q5 3(ANODE_2) 4(CATHODE_2) 5(EMITTER_2) 6(COLLECTOR_2)

### Notes on the sheet
- Test Points
  SDAO
  SDAI
  SCL (Non-Isolated)

### Library data of the parts
F1 F2 = 0ADKP0500-RE: Fuse
IC5 = LTC4151IMS-1#PBF: Integrated Circuit; Manufacturer_Name: Analog Devices; Datasheet Link: https://www.analog.com/media/en/technical-documentation/data-sheets/4151ff.pdf; Height: 1.1mm; Manufacturer_Part_Number: LTC4151IMS-1#PBF; Mouser Part Number: 584-LTC4151IMS-1#PBF; Mouser Price/Stock: https://www.mouser.co.uk/ProductDetail/Analog-Devices/LTC4151IMS-1PBF?qs=hVkxg5c3xu8GkocOuUpsIw%3D%3D; Arrow Part Number: LTC4151IMS-1#PBF; Arrow Price/Stock: https://www.arrow.com/en/products/ltc4151ims-1pbf/linear-technology
Q4 Q5 = MOCD207M: Transistor; Manufacturer_Name: onsemi; Datasheet Link: https://www.onsemi.com/pub/Collateral/MOCD217M-D.PDF; Height: 3.63mm; Manufacturer_Part_Number: MOCD207M; Mouser Part Number: 512-MOCD207M; Mouser Price/Stock: https://www.mouser.co.uk/ProductDetail/onsemi-Fairchild/MOCD207M?qs=Z0HAwyWrFkxA8A7IbmLQiA%3D%3D; Arrow Part Number: MOCD207M; Arrow Price/Stock: https://www.arrow.com/en/products/mocd207m/on-semiconductor?region=europe
R15 = ERJ-P08D3303V: Resistor; Manufacturer_Name: Panasonic; Datasheet Link: http://industrial.panasonic.com/cdbs/www-data/pdf/RDO0000/AOA0000C331.pdf; Height: 0.7mm; Manufacturer_Part_Number: ERJ-P08D3303V
R16 = MCA12060C1003FP500: Resistor; Manufacturer_Name: Vishay; Datasheet Link: https://componentsearchengine.com/Datasheets/1/MCA12060C1003FP500.pdf; Height: 0.65mm; Manufacturer_Part_Number: MCA12060C1003FP500; Mouser Part Number: 594-MCA12060C1003FP5; Mouser Price/Stock: https://www.mouser.com/Search/Refine.aspx?Keyword=594-MCA12060C1003FP5
R17 = PCS1206DR0200ET: Resistor; Manufacturer_Name: Ohmite; Datasheet Link: https://componentsearchengine.com/Datasheets/1/PCS1206DR0200ET.pdf; Height: 0.684mm; Manufacturer_Part_Number: PCS1206DR0200ET; Mouser Part Number: 588-PCS1206DR0200ET; Mouser Price/Stock: https://www.mouser.co.uk/ProductDetail/Ohmite/PCS1206DR0200ET?qs=Zz7%252BYVVL6bHe1REzh6xp%2Fw%3D%3D
R18 R19 = ERA-8APB203V: Resistor; Manufacturer_Name: Panasonic; Datasheet Link: https://industrial.panasonic.com/cdbs/www-data/pdf/RDM0000/AOA0000C307.pdf; Height: 0.7mm; Manufacturer_Part_Number: ERA-8APB203V; Mouser Part Number: 667-ERA-8APB203V; Mouser Price/Stock: https://www.mouser.co.uk/ProductDetail/Panasonic/ERA-8APB203V?qs=PgLP5AltfozIbJaoHBTq0Q%3D%3D
R20 = CRCW12065K10FKEAHP: Resistor; Manufacturer_Name: Vishay; Datasheet Link: http://componentsearchengine.com/Datasheets/1/CRCW12065K10FKEAHP.pdf; Height: 0.65mm; Manufacturer_Part_Number: CRCW12065K10FKEAHP; Mouser Part Number: 71-CRCW12065K10FKEAH; Mouser Price/Stock: https://www.mouser.co.uk/ProductDetail/Vishay-Dale/CRCW12065K10FKEAHP?qs=YmE2lSBYOPkBMGQxuoTowQ%3D%3D; Arrow Part Number: CRCW12065K10FKEAHP; Arrow Price/Stock: https://www.arrow.com/en/products/crcw12065k10fkeahp/vishay?region=nac
R21 R22 = KTR18EZPJ511: Resistor; Manufacturer_Name: ROHM Semiconductor; Datasheet Link: http://rohmfs.rohm.com/en/products/databook/datasheet/passive/resistor/chip_resistor/ktr.pdf; Height: 0.65mm; Manufacturer_Part_Number: KTR18EZPJ511; Mouser Part Number: 755-KTR18EZPJ511; Mouser Price/Stock: https://www.mouser.co.uk/ProductDetail/ROHM-Semiconductor/KTR18EZPJ511?qs=DyUWGjl%252BcVvm7MQRIM2yRQ%3D%3D
R23 R24 = ERJ-P08D1002V: Resistor; Manufacturer_Name: Panasonic; Datasheet Link: http://industrial.panasonic.com/cdbs/www-data/pdf/RDO0000/AOA0000C331.pdf; Height: 0.7mm; Manufacturer_Part_Number: ERJ-P08D1002V; Mouser Part Number: 667-ERJ-P08D1002V; Mouser Price/Stock: https://www.mouser.co.uk/ProductDetail/Panasonic/ERJ-P08D1002V?qs=iIVTEDlrHA2EA%252BOcRk4tPQ%3D%3D; Arrow Part Number: ERJ-P08D1002V; Arrow Price/Stock: https://www.arrow.com/en/products/erj-p08d1002v/panasonic

## Sheet eFuse.SchDoc
size A
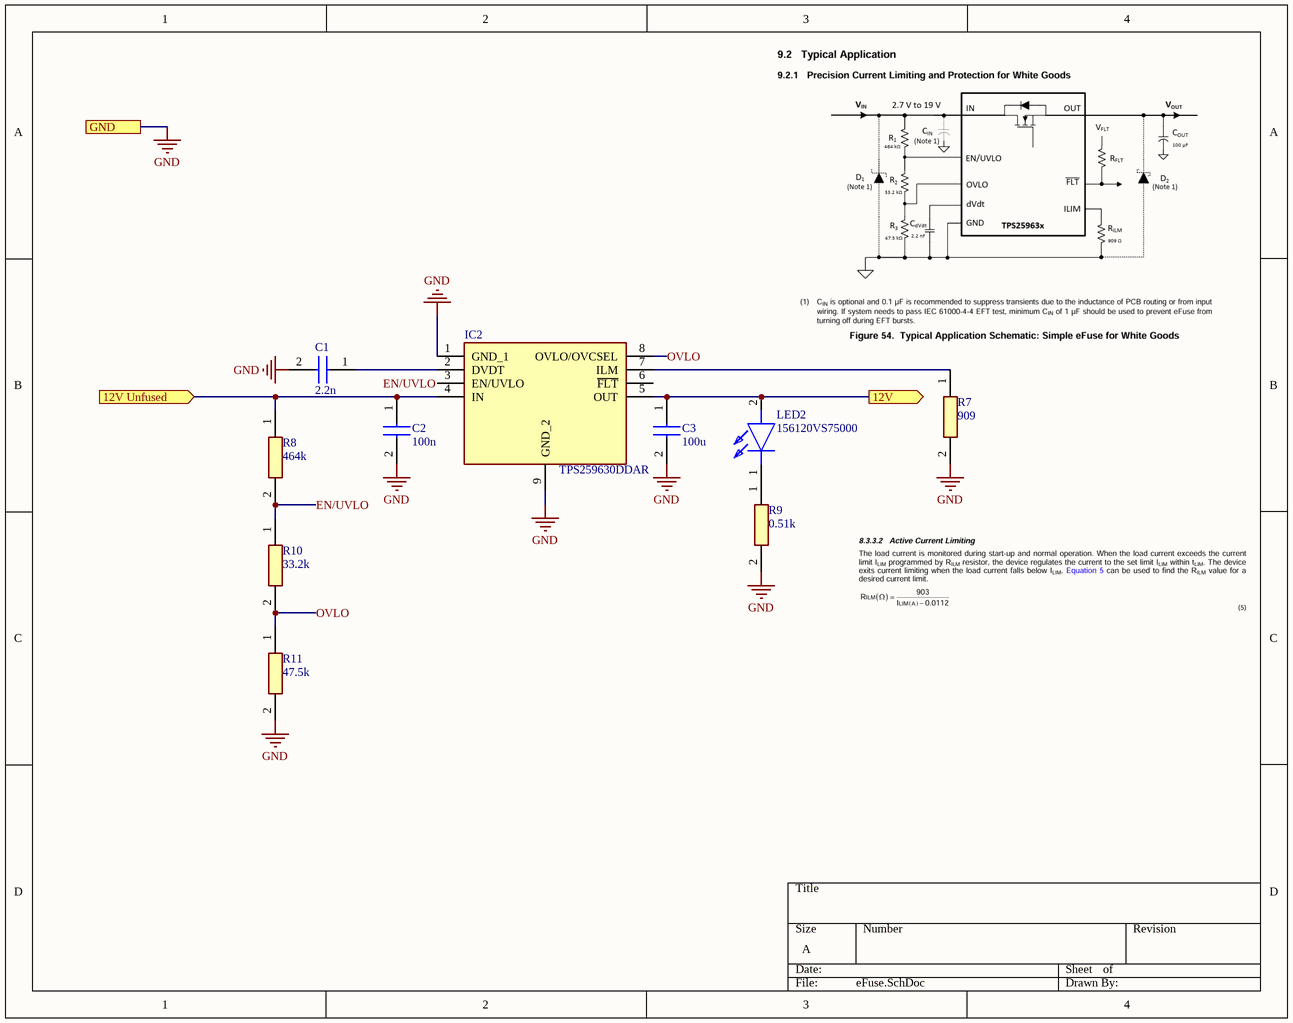
[diagram p7: eFuse.SchDoc]

### Parts
C1  2.2n  [CAPC3216X94N]
C2  100n  [CAPC3216X94N]
C3  100u  [GRM31x]
IC2  TPS259630DDAR  [SOIC127P600X170-9N]
LED2  156120VS75000  [156120VS75000]
R7  909  [ERJ8ENF1000V]
R8  464k  [RESC3216X60N]
R9  0.51k  [RESC3216X65N]
R10  33.2k  [ERJ8ENF1000V]
R11  47.5k  [ERJ8ENF1000V]

### Ports
12V (out), 12V Unfused (in), GND

### Nets
GND: C1.2(C2) C2.2 C3.2 IC2.1(GND_1) IC2.9(GND_2) R7.2 R9.2 R11.2 ; port GND
12V: C3.1 IC2.5(OUT) LED2.2(A) ; port 12V
12V Unfused: C2.1 IC2.4(IN) R8.1 ; port 12V Unfused
EN/UVLO: IC2.3(EN/UVLO) R8.2 R10.1
OVLO: IC2.8(OVLO/OVCSEL) R10.2 R11.1
NetC1_1: C1.1(C1) IC2.2(DVDT)
NetIC2_7: IC2.7(ILM) R7.1
NetLED2_1: LED2.1(K) R9.1

Not connected (* = marked no-connect by the designer): IC2 6(~{FLT})

### Library data of the parts
C1 = 1206YC222KAT2A: Capacitor; Manufacturer_Name: Kyocera AVX; Manufacturer_Part_Number: 1206YC222KAT2A; Mouser Part Number: 581-1206YC222KAT2A; Mouser Price/Stock: https://www.mouser.co.uk/ProductDetail/AVX/1206YC222KAT2A?qs=CvOUr%252B7YgU7sng%252BvNa2zXQ%3D%3D
C2 = 12065C104J4Z2A: as C5 on sheet STM32; Datasheet Link: https://spicat.kyocera-avx.com/product/mlcc/chartview/12065C104J4Z2A/DataSheet/X7R; Height: 0.94mm; Manufacturer_Part_Number: 12065C104J4Z2A; Mouser Part Number: 581-12065C104J4Z2A; Mouser Price/Stock: https://www.mouser.com/Search/Refine.aspx?Keyword=581-12065C104J4Z2A
C3 = GRM31CR60J107KEA8L: Capacitor; Manufacturer_Name: Murata Electronics; Datasheet Link: https://search.murata.co.jp/Ceramy/image/img/A01X/G101/ENG/GRM31CR60J107KEA8-01A.pdf; Height: 1.25mm; Manufacturer_Part_Number: GRM31CR60J107KEA8L; Mouser Part Number: 81-GRM31CR60J107KE8L; Mouser Price/Stock: https://www.mouser.co.uk/ProductDetail/Murata-Electronics/GRM31CR60J107KEA8L?qs=pUKx8fyJudDzdyEEakAKPA%3D%3D
IC2 = TPS259630DDAR: Integrated Circuit; Manufacturer_Name: Texas Instruments; Datasheet Link: https://www.ti.com/lit/gpn/TPS2596; Height: 1.7mm; Manufacturer_Part_Number: TPS259630DDAR; Mouser Part Number: 595-TPS259630DDAR; Mouser Price/Stock: https://www.mouser.co.uk/ProductDetail/Texas-Instruments/TPS259630DDAR?qs=T3oQrply3y%252BCA0rOFESTyA%3D%3D; Arrow Part Number: TPS259630DDAR; Arrow Price/Stock: https://www.arrow.com/en/products/tps259630ddar/texas-instruments
LED2 = 156120VS75000: LED; Manufacturer_Name: Wurth Elektronik; Datasheet Link: https://www.we-online.com/components/products/datasheet/156120VS75000.pdf; Height: 1.3mm; Manufacturer_Part_Number: 156120VS75000; Mouser Part Number: 710-156120VS75000; Mouser Price/Stock: https://www.mouser.co.uk/ProductDetail/Wurth-Elektronik/156120VS75000?qs=2kOmHSv6VfQAUFg5BeuEfQ%3D%3D
R7 = ERJ-8ENF9090V: Resistor; Manufacturer_Name: Panasonic; Datasheet Link: https://industrial.panasonic.com/cdbs/www-data/pdf/RDA0000/AOA0000C86.pdf; Height: 0.7mm; Manufacturer_Part_Number: ERJ-8ENF9090V; Mouser Part Number: 667-ERJ-8ENF9090V; Mouser Price/Stock: https://www.mouser.co.uk/ProductDetail/Panasonic/ERJ-8ENF9090V?qs=Ow%252BOiPmaljFp7qjHXHnn0Q%3D%3D
R8 = CRCW1206464KFKEA: Resistor; Manufacturer_Name: Vishay; Datasheet Link: http://componentsearchengine.com/Datasheets/2/CRCW1206464KFKEA.pdf; Height: 0.6mm; Manufacturer_Part_Number: CRCW1206464KFKEA; Mouser Part Number: 71-CRCW1206-464K-E3; Mouser Price/Stock: https://www.mouser.co.uk/ProductDetail/Vishay-Dale/CRCW1206464KFKEA?qs=9sFvXT%252Bien0sktzQDV2mCw%3D%3D
R9 = KTR18EZPJ511: as R21 on sheet VoltageSense; Datasheet Link: http://rohmfs.rohm.com/en/products/databook/datasheet/passive/resistor/chip_resistor/ktr.pdf; Height: 0.65mm; Manufacturer_Part_Number: KTR18EZPJ511; Mouser Part Number: 755-KTR18EZPJ511; Mouser Price/Stock: https://www.mouser.co.uk/ProductDetail/ROHM-Semiconductor/KTR18EZPJ511?qs=DyUWGjl%252BcVvm7MQRIM2yRQ%3D%3D
R10 = ERJ-8ENF3322V: Resistor; Manufacturer_Name: Panasonic; Datasheet Link: https://industrial.panasonic.com/cdbs/www-data/pdf/RDA0000/AOA0000C86.pdf; Height: 0.7mm; Manufacturer_Part_Number: ERJ-8ENF3322V; Mouser Part Number: 667-ERJ-8ENF3322V; Mouser Price/Stock: https://www.mouser.co.uk/ProductDetail/Panasonic/ERJ-8ENF3322V?qs=8%252BG0TiN%2FgVoP4ztf7NoJ7g%3D%3D; Arrow Part Number: ERJ-8ENF3322V; Arrow Price/Stock: https://www.arrow.com/en/products/erj-8enf3322v/panasonic
R11 = ERJ-8ENF4752V: Resistor; Manufacturer_Name: Panasonic; Datasheet Link: https://industrial.panasonic.com/cdbs/www-data/pdf/RDA0000/AOA0000C86.pdf; Height: 0.7mm; Manufacturer_Part_Number: ERJ-8ENF4752V; Mouser Part Number: 667-ERJ-8ENF4752V; Mouser Price/Stock: https://www.mouser.com/Search/Refine.aspx?Keyword=667-ERJ-8ENF4752V; Arrow Part Number: ERJ-8ENF4752V; Arrow Price/Stock: https://www.arrow.com/en/products/erj-8enf4752v/panasonic

## Sheet 12V_LDO_3_3V.SchDoc
size A; SheetNumber: 4; SheetTotal: 5
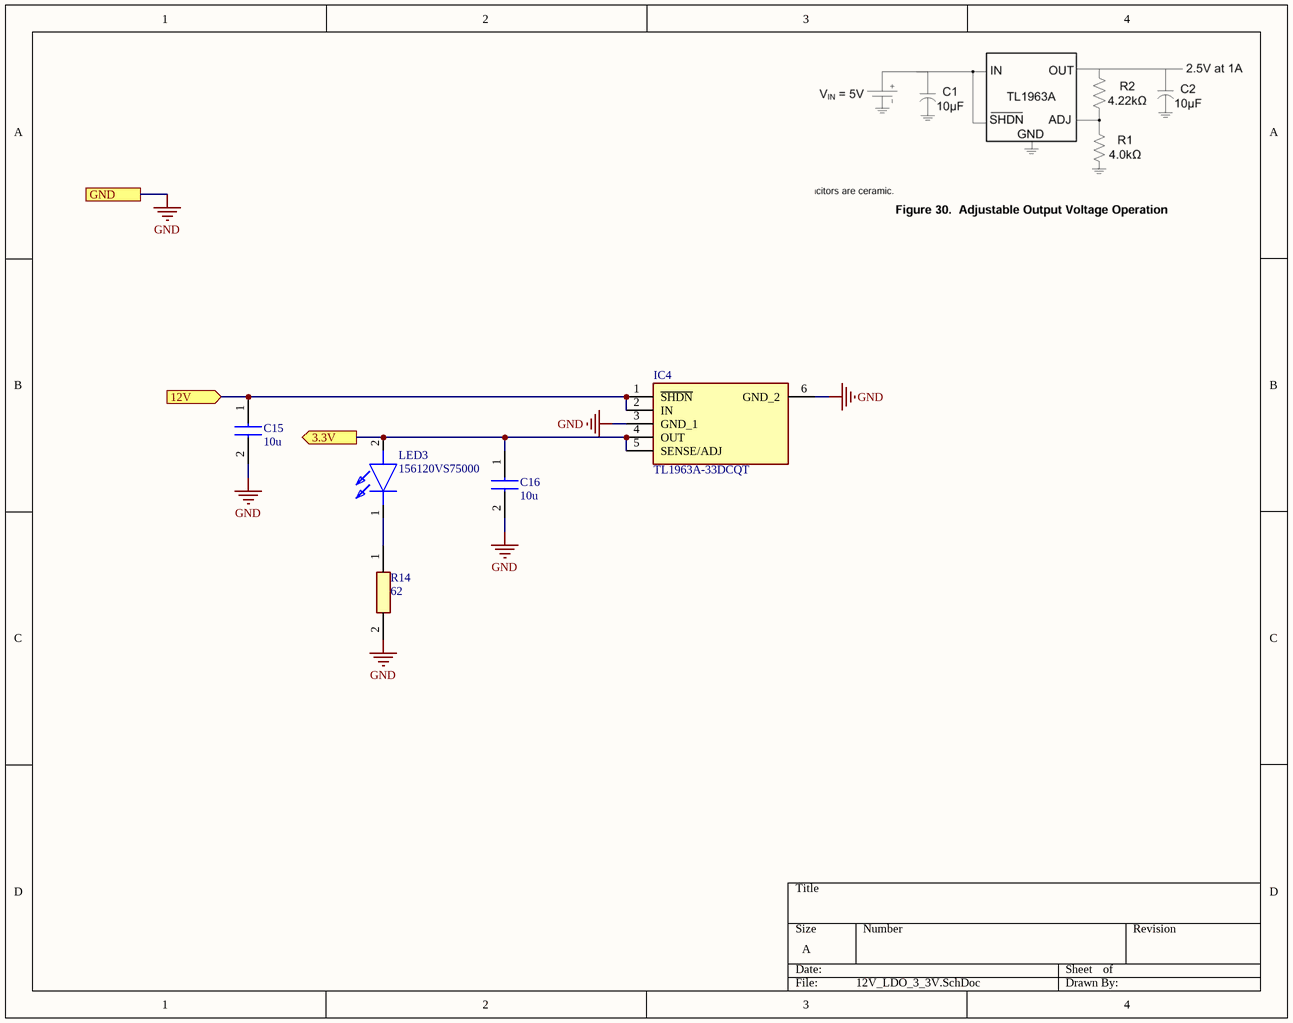
[diagram p8: 12V_LDO_3_3V.SchDoc]

### Parts
C15  10u  [CAPC3216X180N]
C16  10u  [CAPC3216X180N]
IC4  TL1963A-33DCQT  [SOT127P706X180-6N]
LED3  156120VS75000  [156120VS75000]
R14  62  [RESC3216X60N]

### Ports
3.3V (out), 12V (in), GND

### Nets
GND: C15.2 C16.2 IC4.3(GND_1) IC4.6(GND_2) R14.2 ; port GND
3.3V: C16.1 IC4.4(OUT) IC4.5(SENSE/ADJ) LED3.2(A) ; port 3.3V
12V: C15.1 IC4.1(~{SHDN}) IC4.2(IN) ; port 12V
NetLED3_1: LED3.1(K) R14.1

### Library data of the parts
C15 C16 = MLASU31LBB5106KTNA01: Capacitor; Manufacturer_Name: TAIYO YUDEN; Datasheet Link: https://mm.digikey.com/Volume0/opasdata/d220001/medias/docus/5731/MLR01_e.pdf; Height: 1.8mm; Manufacturer_Part_Number: MLASU31LBB5106KTNA01
IC4 = TL1963A-33DCQT: Integrated Circuit; Manufacturer_Name: Texas Instruments; Datasheet Link: http://www.ti.com/lit/gpn/TL1963A; Height: 1.8mm; Manufacturer_Part_Number: TL1963A-33DCQT; Mouser Part Number: 595-TL1963A-33DCQT; Mouser Price/Stock: https://www.mouser.co.uk/ProductDetail/Texas-Instruments/TL1963A-33DCQT?qs=g0HfZ8wh75AyKD2vs560PQ%3D%3D; Arrow Part Number: TL1963A-33DCQT; Arrow Price/Stock: https://www.arrow.com/en/products/tl1963a-33dcqt/texas-instruments?utm_currency=USD&region=nac
LED3 = 156120VS75000: LED; Manufacturer_Name: Wurth Elektronik; Datasheet Link: https://www.we-online.com/components/products/datasheet/156120VS75000.pdf; Height: 1.3mm; Manufacturer_Part_Number: 156120VS75000; Mouser Part Number: 710-156120VS75000; Mouser Price/Stock: https://www.mouser.co.uk/ProductDetail/Wurth-Elektronik/156120VS75000?qs=2kOmHSv6VfQAUFg5BeuEfQ%3D%3D
R14 = CRCW120662R0FKTA: Resistor; Manufacturer_Name: Vishay; Height: 0.6mm; Manufacturer_Part_Number: CRCW120662R0FKTA; Mouser Part Number: 71-CRCW1206-62; Mouser Price/Stock: https://www.mouser.co.uk/ProductDetail/Vishay-Dale/CRCW120662R0FKTA?qs=ZNjI1vpoWDOW7%2FSNU3Zcgg%3D%3D

## Nets that join several sheets
GND: Relay_Control (Q1.2 Q2.2 Q3.2), Connectors (J1.2 J2.2 J9.4), LEDs/U_LED (ICLED3.2), LEDs/U_LED (ICLED2.2), LEDs/U_LED (ICLED1.2), STM32 (19 pins), VoltageSense (Q5.7), eFuse (8 pins), 12V_LDO_3_3V (5 pins)
3.3V: Connectors (J9.3), STM32 (17 pins), VoltageSense (R21.1 R22.1 R23.1 R24.1), 12V_LDO_3_3V (C16.1 IC4.4 IC4.5 LED3.2)
12V: LEDs/U_LED (+_Sig.2), LEDs/U_LED (-_Sig.2), LEDs/U_LED (PC_Sig.2), eFuse (C3.1 IC2.5 LED2.2), 12V_LDO_3_3V (C15.1 IC4.1 IC4.2)
12V Unfused: Relay_Control (D1.1 D2.1 D3.1 K1.3), Connectors (5 pins), eFuse (C2.1 IC2.4 R8.1)
+ Relay GND: Relay_Control (D1.2 Q1.3), Connectors (J4.1)
+ Signal: Relay_Control (Q1.1), LEDs/U_LED (ICLED3.1), STM32 (IC3.37)
- Relay GND: Relay_Control (D2.2 Q2.3), Connectors (J6.1)
- Signal: Relay_Control (Q2.1), LEDs/U_LED (ICLED2.1), STM32 (IC3.35)
HV+ BAT: Relay_Control (K1.1), Connectors (J3.1 J3.2)
HV+ MC Unfused: Relay_Control (R5.2 R5.3), Connectors (J5.1 J5.2), VoltageSense (F1.2)
HV- MC Unfused: Connectors (J8.1 J8.2), VoltageSense (F2.1)
NetIC3_21: Connectors (J12.1), STM32 (IC3.21)
NetIC3_23: Connectors (J12.2), STM32 (IC3.23)
NetIC3_25: Connectors (J12.3), STM32 (IC3.25)
NetIC3_27: Connectors (J12.4), STM32 (IC3.27)
NRST: Connectors (J10.2), STM32 (C11.1 IC3.7 S1.1 S1.3)
PC Signal: Relay_Control (Q3.1), STM32 (IC3.33)
PC Switch COM: Connectors (J2.1), STM32 (IC3.52)
Precharge Relay GND: Relay_Control (D3.2 K1.4 Q3.3), Connectors (J7.1)
SCL: Connectors (J11.2), STM32 (R13.1), VoltageSense (Q4.2 R24.2)
SDA: Connectors (J11.1), STM32 (R12.1), VoltageSense (Q4.4 Q5.8 R23.2)
SWCLK: Connectors (J9.1), STM32 (IC3.49)
SWDIO: Connectors (J9.2), STM32 (IC3.46)
SWO: Connectors (J10.1), STM32 (IC3.55)